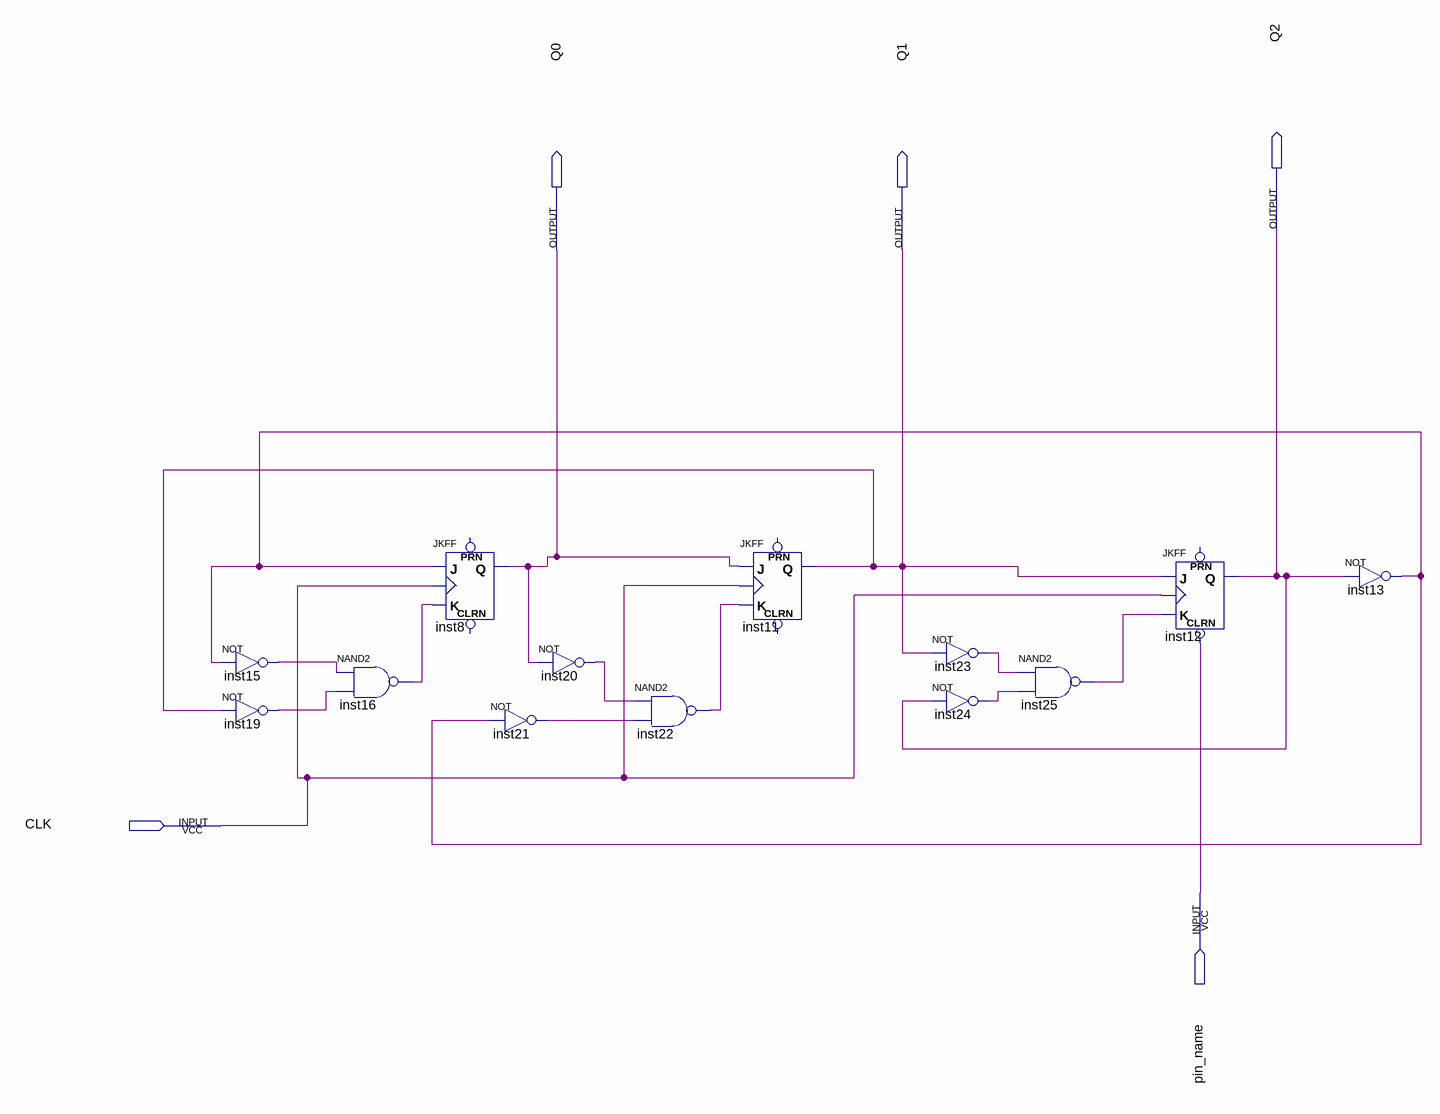
[diagram p0: schematic sheet]
// Quartus schematic lab11.bdf as structural Verilog: 13 symbols, 5 pins
module lab11 (
  input  CLK,
  input  pin_name,
  output Q2,
  output Q0,
  output Q1
);

  wire inst13_out, inst15_out, inst16_out, inst19_out, inst20_out, inst21_out, inst22_out, inst23_out,
       inst24_out, inst25_out;

  not inst15 (inst15_out, inst13_out);
  not inst19 (inst19_out, Q1);
  nand inst16 (inst16_out, inst15_out, inst19_out);
  JKFF inst8 (.K(inst16_out), .J(inst13_out), .CLK(CLK), .Q(Q0));  // open: PRN, CLRN
  not inst20 (inst20_out, Q0);
  not inst21 (inst21_out, inst13_out);
  nand inst22 (inst22_out, inst20_out, inst21_out);
  JKFF inst11 (.K(inst22_out), .J(Q0), .CLK(CLK), .Q(Q1));  // open: PRN, CLRN
  not inst23 (inst23_out, Q1);
  not inst24 (inst24_out, Q2);
  nand inst25 (inst25_out, inst23_out, inst24_out);
  JKFF inst12 (.CLRN(pin_name), .K(inst25_out), .J(Q1), .CLK(CLK), .Q(Q2));  // open: PRN
  not inst13 (inst13_out, Q2);
endmodule
